# Altium schematic sheet WL-MAIN.SchDoc
size 420 x 297 mm; Scale: 1:1; DocumentNumber: 1; SheetNumber: 1; SheetTotal: 12
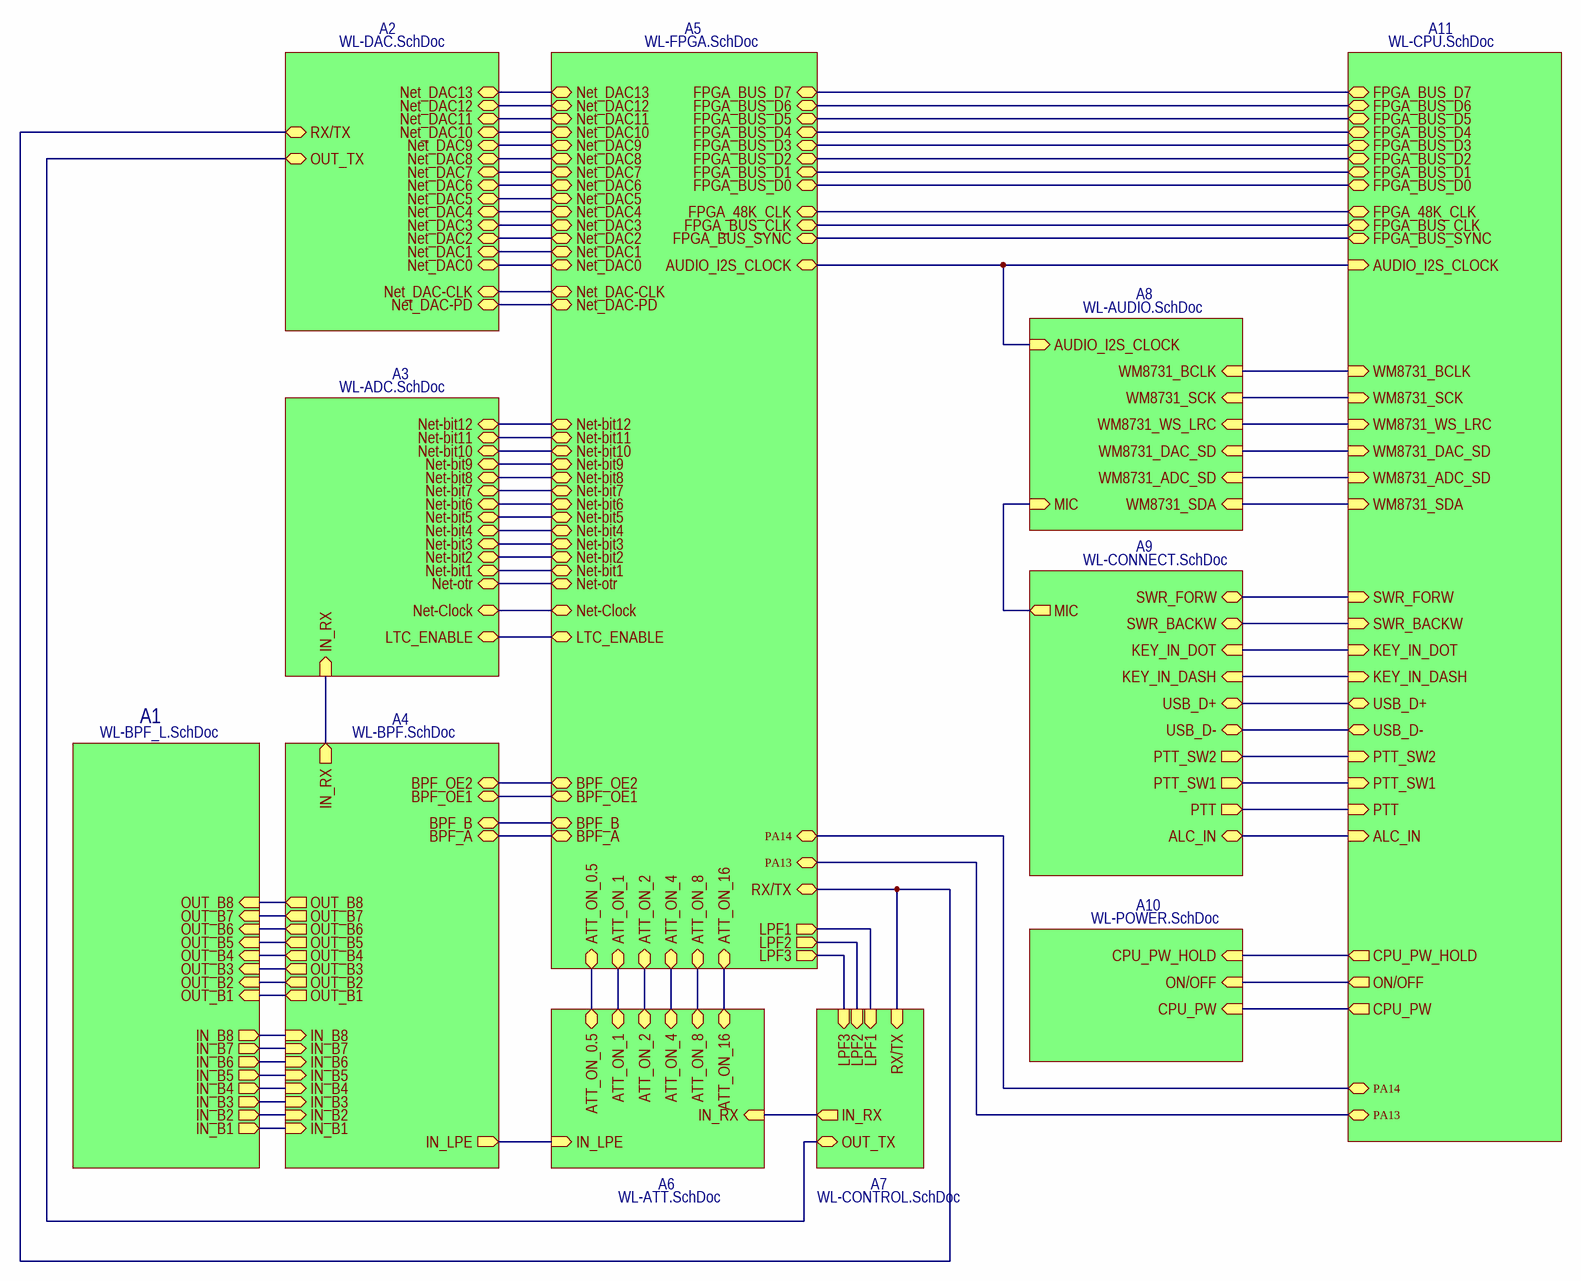
[diagram p0: WL-MAIN.SchDoc]

## Sub-sheets
A1 = WL-BPF_L.SchDoc: OUT_B2 (in), OUT_B3 (in), OUT_B4 (in), OUT_B1 (in), IN_B1 (out), IN_B2 (out), IN_B3 (out), IN_B4 (out), OUT_B7 (in), OUT_B6 (in), OUT_B5 (in), IN_B7 (out), IN_B6 (out), IN_B5 (out), IN_B8 (out), OUT_B8 (in)
A2 = WL-DAC.SchDoc: Net_DAC13 (bidir), Net_DAC2 (bidir), Net_DAC3 (bidir), Net_DAC1 (bidir), Net_DAC0 (bidir), Net_DAC-CLK (bidir), Net_DAC4 (bidir), Net_DAC7 (bidir), Net_DAC10 (bidir), Net_DAC5 (bidir), Net_DAC6 (bidir), Net_DAC11 (bidir), Net_DAC12 (bidir), Net_DAC8 (bidir), Net_DAC9 (bidir), OUT_TX (bidir), Net_DAC-PD (bidir), RX/TX (bidir)
A3 = WL-ADC.SchDoc: Net-bit7 (bidir), Net-bit2 (bidir), Net-bit10 (bidir), Net-bit6 (bidir), Net-bit4 (bidir), Net-bit3 (bidir), Net-bit1 (bidir), Net-bit5 (bidir), Net-bit9 (bidir), Net-otr (bidir), Net-bit8 (bidir), Net-bit11 (bidir), Net-Clock (bidir), Net-bit12 (bidir), LTC_ENABLE (bidir), IN_RX (in)
A4 = WL-BPF.SchDoc: IN_RX (out), BPF_OE2 (bidir), BPF_A (bidir), BPF_B (bidir), BPF_OE1 (bidir), OUT_B8 (out), OUT_B7 (out), OUT_B6 (out), OUT_B5 (out), OUT_B4 (out), OUT_B3 (out), OUT_B2 (out), OUT_B1 (out), IN_B1 (in), IN_B2 (in), IN_B3 (in), IN_B4 (in), IN_B5 (in), IN_B6 (in), IN_B7 (in), IN_B8 (in), IN_LPE (out)
A5 = WL-FPGA.SchDoc: FPGA_BUS_D5 (bidir), FPGA_BUS_D2 (bidir), FPGA_BUS_D7 (bidir), AUDIO_I2S_CLOCK (bidir), FPGA_BUS_D4 (bidir), FPGA_BUS_D1 (bidir), FPGA_48K_CLK (bidir), FPGA_BUS_D6 (bidir), FPGA_BUS_D3 (bidir), FPGA_BUS_D0 (bidir), FPGA_BUS_CLK (bidir), FPGA_BUS_SYNC (bidir), ATT_ON_0.5 (bidir), ATT_ON_1 (bidir), ATT_ON_2 (bidir), ATT_ON_4 (bidir), ATT_ON_8 (bidir), ATT_ON_16 (bidir), Net_DAC13 (bidir), Net_DAC2 (bidir), Net_DAC3 (bidir), Net_DAC1 (bidir), Net_DAC0 (bidir), Net_DAC-CLK (bidir), Net_DAC4 (bidir), Net_DAC7 (bidir), Net_DAC10 (bidir), Net_DAC5 (bidir), Net_DAC6 (bidir), Net_DAC11 (bidir), Net_DAC12 (bidir), Net_DAC8 (bidir), Net_DAC9 (bidir), Net-bit7 (bidir), Net-bit2 (bidir), Net-bit10 (bidir), Net-bit6 (bidir), Net-bit4 (bidir), Net-bit3 (bidir), Net-bit1 (bidir), Net-bit5 (bidir), Net-bit9 (bidir), Net-otr (bidir), Net-bit8 (bidir), Net-bit11 (bidir), Net-Clock (bidir), Net-bit12 (bidir), BPF_OE2 (bidir), BPF_A (bidir), BPF_B (bidir), BPF_OE1 (bidir), LPF2 (out), LPF1 (out), LPF3 (out), Net_DAC-PD (bidir), RX/TX (bidir), LTC_ENABLE (bidir), PA14 (bidir), PA13 (bidir)
A6 = WL-ATT.SchDoc: ATT_ON_1 (bidir), ATT_ON_2 (bidir), ATT_ON_16 (bidir), ATT_ON_8 (bidir), ATT_ON_4 (bidir), ATT_ON_0.5 (bidir), IN_LPE (in), IN_RX (in)
A7 = WL-CONTROL.SchDoc: RX/TX (in), OUT_TX (bidir), IN_RX (out), LPF2 (in), LPF1 (in), LPF3 (in)
A8 = WL-AUDIO.SchDoc: MIC (in), WM8731_BCLK (in), WM8731_SCK (in), WM8731_WS_LRC (in), AUDIO_I2S_CLOCK (in), WM8731_DAC_SD (in), WM8731_ADC_SD (in), WM8731_SDA (in)
A9 = WL-CONNECT.SchDoc: USB_D- (bidir), PTT (out), MIC (out), USB_D+ (bidir), PTT_SW2 (out), PTT_SW1 (out), ALC_IN (bidir), KEY_IN_DASH (in), KEY_IN_DOT (in), SWR_FORW (bidir), SWR_BACKW (bidir)
A10 = WL-POWER.SchDoc: CPU_PW_HOLD (in), ON/OFF (in), CPU_PW (in)
A11 = WL-CPU.SchDoc: USB_D+ (bidir), USB_D- (bidir), PTT_SW2 (in), PTT_SW1 (in), PTT (in), FPGA_BUS_D5 (bidir), FPGA_BUS_D2 (bidir), FPGA_BUS_D7 (bidir), FPGA_BUS_D4 (bidir), FPGA_BUS_D1 (bidir), FPGA_48K_CLK (bidir), FPGA_BUS_D6 (bidir), FPGA_BUS_D3 (bidir), FPGA_BUS_D0 (bidir), FPGA_BUS_CLK (bidir), FPGA_BUS_SYNC (bidir), CPU_PW_HOLD (out), ON/OFF (out), CPU_PW (out), KEY_IN_DOT (in), KEY_IN_DASH (in), SWR_FORW (in), SWR_BACKW (in), ALC_IN (in), AUDIO_I2S_CLOCK (in), WM8731_SCK (in), WM8731_BCLK (in), WM8731_WS_LRC (in), WM8731_DAC_SD (in), WM8731_ADC_SD (in), WM8731_SDA (in), PA14 (bidir), PA13 (bidir)

## Nets
(unnamed): sheet A10/CPU_PW_HOLD, sheet A11/CPU_PW_HOLD
(unnamed): sheet A10/ON/OFF, sheet A11/ON/OFF
(unnamed): sheet A10/CPU_PW, sheet A11/CPU_PW
(unnamed): sheet A3/Net-bit7, sheet A5/Net-bit7
(unnamed): sheet A3/Net-bit2, sheet A5/Net-bit2
(unnamed): sheet A3/Net-bit10, sheet A5/Net-bit10
(unnamed): sheet A3/Net-bit6, sheet A5/Net-bit6
(unnamed): sheet A3/Net-bit4, sheet A5/Net-bit4
(unnamed): sheet A3/Net-bit3, sheet A5/Net-bit3
(unnamed): sheet A3/Net-bit1, sheet A5/Net-bit1
(unnamed): sheet A3/Net-bit5, sheet A5/Net-bit5
(unnamed): sheet A3/Net-bit9, sheet A5/Net-bit9
(unnamed): sheet A3/Net-otr, sheet A5/Net-otr
(unnamed): sheet A3/Net-bit8, sheet A5/Net-bit8
(unnamed): sheet A3/Net-bit11, sheet A5/Net-bit11
(unnamed): sheet A3/Net-Clock, sheet A5/Net-Clock
(unnamed): sheet A3/Net-bit12, sheet A5/Net-bit12
(unnamed): sheet A3/LTC_ENABLE, sheet A5/LTC_ENABLE
(unnamed): sheet A3/IN_RX, sheet A4/IN_RX
(unnamed): sheet A5/FPGA_BUS_D5, sheet A11/FPGA_BUS_D5
(unnamed): sheet A5/FPGA_BUS_D2, sheet A11/FPGA_BUS_D2
(unnamed): sheet A5/FPGA_BUS_D7, sheet A11/FPGA_BUS_D7
(unnamed): sheet A5/AUDIO_I2S_CLOCK, sheet A11/AUDIO_I2S_CLOCK, sheet A8/AUDIO_I2S_CLOCK
(unnamed): sheet A5/FPGA_BUS_D4, sheet A11/FPGA_BUS_D4
(unnamed): sheet A5/FPGA_BUS_D1, sheet A11/FPGA_BUS_D1
(unnamed): sheet A5/FPGA_48K_CLK, sheet A11/FPGA_48K_CLK
(unnamed): sheet A5/FPGA_BUS_D6, sheet A11/FPGA_BUS_D6
(unnamed): sheet A5/FPGA_BUS_D3, sheet A11/FPGA_BUS_D3
(unnamed): sheet A5/FPGA_BUS_D0, sheet A11/FPGA_BUS_D0
(unnamed): sheet A5/FPGA_BUS_CLK, sheet A11/FPGA_BUS_CLK
(unnamed): sheet A5/FPGA_BUS_SYNC, sheet A11/FPGA_BUS_SYNC
(unnamed): sheet A5/ATT_ON_0.5, sheet A6/ATT_ON_0.5
(unnamed): sheet A5/ATT_ON_1, sheet A6/ATT_ON_1
(unnamed): sheet A5/ATT_ON_2, sheet A6/ATT_ON_2
(unnamed): sheet A5/ATT_ON_4, sheet A6/ATT_ON_4
(unnamed): sheet A5/ATT_ON_8, sheet A6/ATT_ON_8
(unnamed): sheet A5/ATT_ON_16, sheet A6/ATT_ON_16
(unnamed): sheet A5/Net_DAC13, sheet A2/Net_DAC13
(unnamed): sheet A5/Net_DAC2, sheet A2/Net_DAC2
(unnamed): sheet A5/Net_DAC3, sheet A2/Net_DAC3
(unnamed): sheet A5/Net_DAC1, sheet A2/Net_DAC1
(unnamed): sheet A5/Net_DAC0, sheet A2/Net_DAC0
(unnamed): sheet A5/Net_DAC-CLK, sheet A2/Net_DAC-CLK
(unnamed): sheet A5/Net_DAC4, sheet A2/Net_DAC4
(unnamed): sheet A5/Net_DAC7, sheet A2/Net_DAC7
(unnamed): sheet A5/Net_DAC10, sheet A2/Net_DAC10
(unnamed): sheet A5/Net_DAC5, sheet A2/Net_DAC5
(unnamed): sheet A5/Net_DAC6, sheet A2/Net_DAC6
(unnamed): sheet A5/Net_DAC11, sheet A2/Net_DAC11
(unnamed): sheet A5/Net_DAC12, sheet A2/Net_DAC12
(unnamed): sheet A5/Net_DAC8, sheet A2/Net_DAC8
(unnamed): sheet A5/Net_DAC9, sheet A2/Net_DAC9
(unnamed): sheet A5/BPF_OE2, sheet A4/BPF_OE2
(unnamed): sheet A5/BPF_A, sheet A4/BPF_A
(unnamed): sheet A5/BPF_B, sheet A4/BPF_B
(unnamed): sheet A5/BPF_OE1, sheet A4/BPF_OE1
(unnamed): sheet A5/LPF2, sheet A7/LPF2
(unnamed): sheet A5/LPF1, sheet A7/LPF1
(unnamed): sheet A5/LPF3, sheet A7/LPF3
(unnamed): sheet A5/Net_DAC-PD, sheet A2/Net_DAC-PD
(unnamed): sheet A5/RX/TX, sheet A2/RX/TX, sheet A7/RX/TX
(unnamed): sheet A5/PA14, sheet A11/PA14
(unnamed): sheet A5/PA13, sheet A11/PA13
(unnamed): sheet A2/OUT_TX, sheet A7/OUT_TX
(unnamed): sheet A6/IN_LPE, sheet A4/IN_LPE
(unnamed): sheet A6/IN_RX, sheet A7/IN_RX
(unnamed): sheet A11/USB_D+, sheet A9/USB_D+
(unnamed): sheet A11/USB_D-, sheet A9/USB_D-
(unnamed): sheet A11/PTT_SW2, sheet A9/PTT_SW2
(unnamed): sheet A11/PTT_SW1, sheet A9/PTT_SW1
(unnamed): sheet A11/PTT, sheet A9/PTT
(unnamed): sheet A11/KEY_IN_DOT, sheet A9/KEY_IN_DOT
(unnamed): sheet A11/KEY_IN_DASH, sheet A9/KEY_IN_DASH
(unnamed): sheet A11/SWR_FORW, sheet A9/SWR_FORW
(unnamed): sheet A11/SWR_BACKW, sheet A9/SWR_BACKW
(unnamed): sheet A11/ALC_IN, sheet A9/ALC_IN
(unnamed): sheet A11/WM8731_SCK, sheet A8/WM8731_SCK
(unnamed): sheet A11/WM8731_BCLK, sheet A8/WM8731_BCLK
(unnamed): sheet A11/WM8731_WS_LRC, sheet A8/WM8731_WS_LRC
(unnamed): sheet A11/WM8731_DAC_SD, sheet A8/WM8731_DAC_SD
(unnamed): sheet A11/WM8731_ADC_SD, sheet A8/WM8731_ADC_SD
(unnamed): sheet A11/WM8731_SDA, sheet A8/WM8731_SDA
(unnamed): sheet A8/MIC, sheet A9/MIC
(unnamed): sheet A4/OUT_B8, sheet A1/OUT_B8
(unnamed): sheet A4/OUT_B7, sheet A1/OUT_B7
(unnamed): sheet A4/OUT_B6, sheet A1/OUT_B6
(unnamed): sheet A4/OUT_B5, sheet A1/OUT_B5
(unnamed): sheet A4/OUT_B4, sheet A1/OUT_B4
(unnamed): sheet A4/OUT_B3, sheet A1/OUT_B3
(unnamed): sheet A4/OUT_B2, sheet A1/OUT_B2
(unnamed): sheet A4/OUT_B1, sheet A1/OUT_B1
(unnamed): sheet A4/IN_B1, sheet A1/IN_B1
(unnamed): sheet A4/IN_B2, sheet A1/IN_B2
(unnamed): sheet A4/IN_B3, sheet A1/IN_B3
(unnamed): sheet A4/IN_B4, sheet A1/IN_B4
(unnamed): sheet A4/IN_B5, sheet A1/IN_B5
(unnamed): sheet A4/IN_B6, sheet A1/IN_B6
(unnamed): sheet A4/IN_B7, sheet A1/IN_B7
(unnamed): sheet A4/IN_B8, sheet A1/IN_B8

## Notes on the sheet
- Перв. примен.
- Справ. №
- Подп. дата
- Инв. № дубл.
- Взам. инв. №
- Подп. и дата
- Изм.
- Разраб.
- Лист
- № докум.
- Подп.
- Дата
- Лит.
- Масса
- Масштаб
- Пров.
- Т.контр.
- Листов
- Инв. № подл.
- Н.контр.
- Утв.
- UT2CW LAB
- ALTIUM GOSTBOM2.0 KEV
- Файл:
- Копировал
- Формат А3